# Altium schematic sheet Full_Schematic.SchDoc
size A3; SheetNumber: 1; SheetTotal: 1
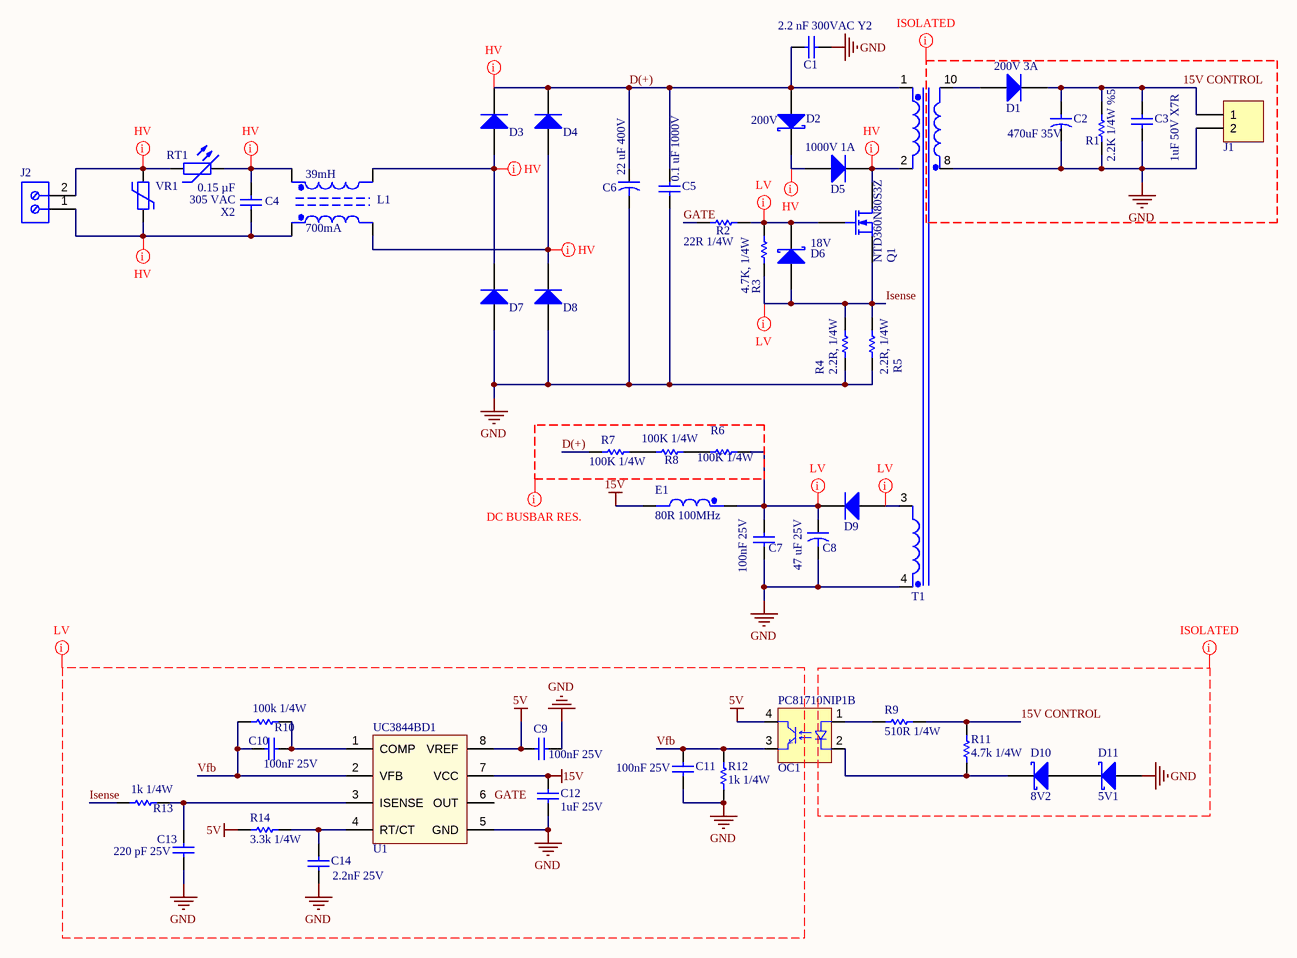
[diagram p0: Full_Schematic.SchDoc]

## Parts
C1  2.2 nF 300VAC Y2  [4x13x9]
C2  470uF 35V  [CAPPRD500W60D1025H1750]
C3  1uF 50V X7R  [1206]
C4  value 0.15 µF  Ratings: X2  Voltage Rating - AC: 305 VAC  [CFR F15 L18 B6 H12]  (hidden comment: MPX154K305E)
C5  0.1 uF 1000V  [RCE7U2J333J5B1H03B]
C6  22 uF 400V  [22uF 400V]
C7  100nF 25V  [1206]
C8  47 uF 25V  [CAPPRD200W50D525H1250]
C9  100nF 25V  [R 1206]
C10  100nF 25V  [1206]
C11  100nF 25V  [1206]
C12  1uF 25V  [R 1206]
C13  220 pF 25V  [1206]
C14  2.2nF 25V  [1206]
D1  200V 3A  [DO-201AD -Dik]
D2  200V  [DO-15((DO-204AC)]
D3  1N4007FLTR  [DO-214AA(SMB)]  (value not drawn)
D4  1N4007FLTR  [DO-214AA(SMB)]  (value not drawn)
D5  1000V 1A  [DO-214AA(SMB)]
D6  18V  [SOD-123]
D7  1N4007FLTR  [DO-214AA(SMB)]  (value not drawn)
D8  1N4007FLTR  [DO-214AA(SMB)]  (value not drawn)
D9  ES2D  [DO-214AA(SMB)]  (value not drawn)
D10  8V2  [SOD-123]
D11  5V1  [SOD-123]
E1  80R 100MHz  [1206 Bead]
J1  691210910002  [Header 2pin 2.54mm Vidalı]  (value not drawn)
J2  691214410002  [Header 2 Pin 7.62mm Vidalı]  (value not drawn)
L1  value 39mH  Max Current Rating: 700mA  [EMC SMPS TDK]  (hidden comment: 39mH 0.7A B82732R2701B030)
OC1  PC81710NIP1B  [PC817 SMD]
Q1  NTD360N80S3Z  [DPAK IGBT]
R1  2.2K 1/4W %5  [R 1206]
R2  22R 1/4W  [R 1206]
R3  4.7K, 1/4W  [R 1206]
R4  2.2R, 1/4W  [R 1206]
R5  2.2R, 1/4W  [R 1206]
R6  100K 1/4W  [R 1206]
R7  100K 1/4W  [R 1206]
R8  100K 1/4W  [R 1206]
R9  510R 1/4W  [R 1206]
R10  100k 1/4W  [R 1206]
R11  4.7k 1/4W  [R 1206]
R12  1k 1/4W  [1206]
R13  1k 1/4W  [R 1206]
R14  3.3k 1/4W  [R 1206]
RT1  NTC  B57153S0100M000  [NTC B57153S0100]  (value not drawn)
T1  SMPS Tr  [SMPS Tr3]  (value not drawn)
U1  UC3844BD1  [SOIC-OA8_L]
VR1  B72314P2301K101  [Varistor630V]  (value not drawn)

## Nets
5V: C9.1 OC1.4(C) R14.1 U1.8(VREF)
15V: C12.2 E1.2 U1.7(VCC)
GND: C1.2 C2.2 C3.1 C5.1 C6.2 C7.1 C8.2 C9.2 C11.1 C12.1 C13.1 C14.1 D7.1(A) D8.1(A) D11.1(A) J1.2 R1.1 R4.1 R5.1 R12.1 T1.4(Sec3-) T1.8 U1.5(GND)
15V CONTROL: C2.1 C3.2 D1.2(K) J1.1 R1.2 R9.1 R11.1
D(+): C1.1 C5.2 C6.1 D2.1(A) D3.2(K) D4.2(K) R7.1 T1.1(Pri+)
GATE: R2.2 U1.6(OUT)
Isense: D6.1(A) Q1.3(S) R3.1 R4.2 R5.2 R13.1
Vfb: C10.1 C11.2 OC1.3(E) R10.1 R12.2 U1.2(VFB)
NetC4_1: C4.1 J2.1 L1.1 VR1.1
NetC4_2: C4.2 L1.2 RT1.2
NetC7_2: C7.2 C8.1 D9.2(K) E1.1 R6.2
NetC10_2: C10.2 R10.2 U1.1(COMP)
NetC13_2: C13.2 R13.2 U1.3(ISENSE)
NetC14_2: C14.2 R14.2 U1.4(RT/CT)
NetD1_1: D1.1(A) T1.10(Sec1+)
NetD2_2: D2.2(K) D5.1(A)
NetD3_1: D3.1(A) D7.2(K) L1.3
NetD4_1: D4.1(A) D8.2(K) L1.4
NetD5_2: D5.2(K) Q1.2(D) T1.2(Pri-)
NetD6_2: D6.2(K) Q1.1(G) R2.1 R3.2
NetD9_1: D9.1(A) T1.3(Sec3+)
NetD10_1: D10.1(A) D11.2(K)
NetD10_2: D10.2(K) OC1.2(K) R11.2
NetJ2_2: J2.2 RT1.1 VR1.2
NetOC1_1: OC1.1(A) R9.2
NetR6_1: R6.1 R8.2
NetR7_2: R7.2 R8.1

## Layout directives
net class HV: D(+), NetC4_1, NetC4_2, NetD2_2, NetD3_1, NetD4_1, NetD5_2, NetJ2_2
net class ISO: 15V CONTROL, GND
net class LV: 5V, 15V, GATE, GND, Isense, NetC7_2, NetD6_2, NetD9_1, Vfb
net class DC BUSBAR: D(+)

## Notes on the sheet
- Document Name
- Prepared By
- Company Name
- Checked By
- A. Can KARACAN
- Release Date
- Department
- R&D- Hardware
- Size
- Change Date
- A3
- Approved By
- Sheet
- /

## Library data of the parts
C1 = Cap Y2 2.2nF 300V MKP TDK: Film Capacitor, Polypropylene, 1500V, 20% +Tol, 20% -Tol, 0.0022uF, Through Hole Mount; Manufacturer: TDK EPCOS; Manufacturer Part Number: B32021A3222M189; Designed By: Ahmet Can; Voltage Rating - AC: 300V; Value: 2.2nF; Published: 8-Jun-2000; LatestRevisionDate: 17-Jul-2002; LatestRevisionNote: Re-released for DXP Platform.; PackageReference: RAD-0.3; Publisher: Altium Limited; PackageDescription: Radial Cap, Thru-Hole; 2 Leads; 0.3 in Pin Spacing; Supplier: Digi-Key; Supplier Part Number: 495-4967-1-ND; RoHS: Yes; Category: Film Capacitors; Stock: 48399; Pricing: 1=0,69, 10=0,509, 50=0,407, 100=0,3488, 500=0,27614 (USD); ComponentLink1URL: https://datasheet.ciiva.com/26855/getdatasheetpartid-407539-26855093.pdf?src-supplier=Verical; ComponentLink1Description: https://datasheet.ciiva.com/26855/getdatasheetpartid-407539-26855093.pdf?src-supplier=Verical; ComponentLink2URL: https://datasheet.ciiva.com/7614/y2-b32021-026-7614902.pdf?src-supplier=Digi-Key; ComponentLink2Description: https://datasheet.ciiva.com/7614/y2-b32021-026-7614902.pdf?src-supplier=Digi-Key; ComponentLink3URL: https://datasheet.ciiva.com/2995/y2-b32021-026-2995030.pdf?src-supplier=Avnet; ComponentLink3Description: https://datasheet.ciiva.com/2995/y2-b32021-026-2995030.pdf?src-supplier=Avnet; Ratings: Y2
C2 = C 470uF 35V 1.76A 28mOhm: Cap Aluminum 470uF 35V 20% (10 X 16mm) Radial 5mm 1760mA 10000h 105 C Bulk; Manufacturer: Rubycon; Manufacturer Part Number: 35ZLH470MEFC10X16; Dielectric Material: Aluminium; Ripple Current: 1.76A; Life (Hours): 10000Hour; Impedance: 28mR; Leakage Current: 3uA; Lead Diameter: 0.6mm; Ripple Current @ High Frequency: 1.76 A @ 100 kHz; Designed By: Ahmet Can; Supplier: Digi-Key; Supplier Part Number: 1189-1890-ND; RoHS: Yes; Category: Aluminum Electrolytic Capacitors; Stock: 201638; Pricing: 1=0,69, 100=0,3201, 500=0,23712, 2500=0,18969 (USD); Mounting Technology: Through Hole; Case/Package: Radial; Min Operating Temperature: -40°C; Max Operating Temperature: 105°C; Value: 470uF; Tolerance: 20%; Termination: Radial; Voltage Rating: 35V; Packaging: Bulk; Voltage: 35V; Series: ZLH; Construction: RADIAL; Diameter: 10mm; Height: 16mm; Lead Pitch: 5mm; Radiation Hardening: No; Reach SVHC Compliant: No; Lead Free: Lead Free; RoHS Compliant: Yes; ComponentLink1URL: https://datasheet.ciiva.com/11690/e-zlh-11690967.pdf?src-supplier=Avnet; ComponentLink1Description: https://datasheet.ciiva.com/11690/e-zlh-11690967.pdf?src-supplier=Avnet; ComponentLink2URL: https://datasheet.ciiva.com/1456/50911-1456223.pdf?src-supplier=Element14; ComponentLink2Description: https://datasheet.ciiva.com/1456/50911-1456223.pdf?src-supplier=Element14
C3 C7 C9-C14 = C 1206: SMD 1206; Deger: *
C4 = Cap 150nF 305VAC X2: MPX Boxed Metalized Propylene X2 Class Interference Suppressor Film Capacitors; Manufacturer: Cornell Dubilier; Designed By: Ahmet Can; Supplier: Digi-Key; Supplier Part Number: 1572-1789-ND; Manufacturer Part Number: MPX154K305E; RoHS: No; Stock: 3283; Pricing: 1=0,5, 10=0,356, 40=0,26925, 80=0,2345, 500=0,17372, 1000=0,14766, 2500=0,13898, 5000=0,13029 (USD); ComponentLink1URL: http://www.illinoiscapacitor.com/pdf/seriesDocuments/MPX%20series.pdf?src-supplier=Digi-Key; ComponentLink1Description: http://www.illinoiscapacitor.com/pdf/seriesDocuments/MPX%20series.pdf?src-supplier=Digi-Key
C5 = C Seramik 100nF 1kV X7R 5mm: Cap Ceramic 0.1uF 1000V X7R 10% Radial 5mm 125°C Bulk; Manufacturer: Murata; Manufacturer Part Number: RDER73A104K5B1H03B; Value: 100nF; Voltage Rated: 1 kW; Published: 8-Jun-2000; LatestRevisionDate: 17-Jul-2002; LatestRevisionNote: Re-released for DXP Platform.; PackageReference: RAD-0.3; Publisher: Altium Limited; PackageDescription: Radial Cap, Thru-Hole; 2 Leads; 0.3 in Pin Spacing; Supplier: Digi-Key; Supplier Part Number: 490-8944-ND; RoHS: Yes; Category: Ceramic Capacitors; Stock: 3259; Pricing: 1=1,31, 10=1,037, 50=0,8988, 100=0,7778, 500=0,5877, 1000=0,51856, 2500=0,48399, 5000=0,46671 (USD); ComponentLink1URL: https://datasheet.ciiva.com/29539/product-29539039.pdf?src-supplier=Digi-Key; ComponentLink1Description: https://datasheet.ciiva.com/29539/product-29539039.pdf?src-supplier=Digi-Key
C6 = C 22uF 400V 270mArms: Cap Aluminum Lytic 22uF 400V 20%( 12.5 X 16mm) Radial 5mm 180mA 2000h 105C; Manufacturer: Rubycon; Manufacturer Part Number: 400AX22MEFC12.5X16; Ripple Current @ Low Frequency: 180 mA @ 120 Hz; Ripple Current @ High Frequency: 270 mA @ 100 kHz; Designed By: Ahmet Can; Supplier: Digi-Key; Supplier Part Number: 1189-3123-ND; RoHS: Yes; Category: Aluminum Electrolytic Capacitors; Stock: 415; Pricing: 1=1,01, 10=0,768, 50=0,6378, 100=0,5493, 500=0,42524, 1000=0,36617, 2500=0,34255, 5000=0,32483 (USD); Mounting Technology: Through Hole; Case/Package: Radial; Min Operating Temperature: -40°C; Max Operating Temperature: 105°C; Value: 22uF; Voltage Rating: 400V; Tolerance: 20%; Series: AX; RoHS Compliant: Yes; ComponentLink1URL: http://www.rubycon.co.jp/en/catalog/e_pdfs/aluminum/Radial_Lead_Alumi_Eng.pdf?src-supplier=Digi-Key; ComponentLink1Description: http://www.rubycon.co.jp/en/catalog/e_pdfs/aluminum/Radial_Lead_Alumi_Eng.pdf?src-supplier=Digi-Key
C8 = C 47uF 25V 250mArms 400mOhm: RUBYCON         25YXJ47MTA5X11            Electrolytic Capacitor, Miniature, YXJ Series, 47 F,  20%, 25 V, 5 mm, Radial Leaded; Value: 47uF; Ripple Current: 175mA; Impedance: 400mR; Designed By: Ahmet Can; ComponentLink1Description: https://datasheet.ciiva.com/6328/e-yxj-6328843.pdf?src-supplier=Digi-Key; Supplier: Digi-Key; Supplier Part Number: 1189-1590-1-ND; Manufacturer: Rubycon; Manufacturer Part Number: 25YXJ47MTA5X11; RoHS: Yes; Category: Aluminum Electrolytic Capacitors; Stock: 28516; Pricing: 1=0,26, 10=0,176, 50=0,1056, 100=0,0892, 500=0,06106, 1000=0,05401 (USD); Mounting Technology: Through Hole; Case/Package: Radial; Min Operating Temperature: -40°C; Max Operating Temperature: 105°C; Tolerance: 20%; Voltage Rating: 25V; Package Quantity: 2000; Packaging: Cut Tape; Voltage Rating (DC): 25V; Features: General Purpose; Series: YXJ; Diameter: 5mm; Height: 11mm; Lead Pitch: 0.079inch; Height - Seated (Max): 0.492inch; Reach SVHC Compliant: No; RoHS Compliant: Yes; ComponentLink1URL: https://datasheet.ciiva.com/6328/e-yxj-6328843.pdf?src-supplier=Digi-Key; ComponentLink2URL: https://datasheet.ciiva.com/22732/1657883-22732557.pdf?src-supplier=Element14; ComponentLink2Description: https://datasheet.ciiva.com/22732/1657883-22732557.pdf?src-supplier=Element14
D1 = Diyot DO-201AD Dik: Diode Schottky 200V 3A DO201AD; Manufacturer: Sangdest Microelectronics; Manufacturer Part Number: SB3200; Designed By: Ahmet Can; Supplier: Digi-Key; Supplier Part Number: 1655-SB3200CT-ND; RoHS: Yes; Category: Uncategorized; Stock: 8735; Pricing: 1=0,43, 10=0,33, 100=0,198, 500=0,18332 (USD); RoHS Compliant: Yes
D2 = TVS 200V DO-15: Diode Transient Voltage Suppression (TVS) Single Unidirectional 171 Volt 600 Watt 2-Pin DO-15; Manufacturer: STMicroelectronics; Manufacturer Part Number: P6KE200A; Max Clamping Voltage: 353 V; Min Breakdown Voltage: 190 V; Designed By: Ahmet Can; ComponentLink1Description: Manufacturer Link; ComponentLink1URL: http://www.infineon.com/; ComponentLink2Description: Datasheet; ComponentLink2URL: http://www.infineon.com/upload/Document/cmc_upload/documents/009/363/bat17series.pdf; Supplier: Digi-Key; Supplier Part Number: 497-13419-1-ND; RoHS: Yes; Category: TVS Diodes; Stock: 5060; Pricing: 1=0,64, 10=0,567, 100=0,4347, 500=0,34366 (USD); ComponentLink3URL: https://datasheet.ciiva.com/6577/cd00000720-6577909.pdf?src-supplier=Digi-Key; ComponentLink3Description: https://datasheet.ciiva.com/6577/cd00000720-6577909.pdf?src-supplier=Digi-Key; ComponentLink4URL: https://datasheet.ciiva.com/14535/70013976-14535693.pdf?src-supplier=Allied+Electronics; ComponentLink4Description: https://datasheet.ciiva.com/14535/70013976-14535693.pdf?src-supplier=Allied+Electronics; ComponentLink5URL: https://datasheet.ciiva.com/41443/001184001-da-01-en-tvs-diode-171v-1ch-un-p6ke200a-do-15-stm-41443451.pdf?src-supplier=Conrad; ComponentLink5Description: https://datasheet.ciiva.com/41443/001184001-da-01-en-tvs-diode-171v-1ch-un-p6ke200a-do-15-stm-41443451.pdf?src-supplier=Conrad
D3 D4 D7 D8 = D 1N4007 DO-214AA(SMB): Standard Rectifier 1000V SOD-123; DC Reverse Max: 1 kV; Designed By: Ahmet Can
D5 = D 1N4007 DO-214AA(SMB): Standard Rectifier 1000V SOD-123, 1N4007FLTR; DC Reverse Max: 1 kV; Designed By: Ahmet Can
D6 D10 D11 = Zener SOD-123: SOD-123; Note: Pin 2 is not connected and not drawn.; Published: 21-Mar-2003; LatestRevisionDate: 29-May-2009; LatestRevisionNote: IPC-7351 Footprint Added.; DatasheetVersion: Oct-1999; PackageVersion: Sep-2001; PackageReference: SOT-23; Publisher: Altium Limited; PackageDescription: 3-Pin SOT-23 Package 0.95 mm Pitch, 2.5 mm Lead Span; ComponentLink1Description: Manufacturer Link; ComponentLink1URL: http://www.infineon.com/; ComponentLink2Description: Datasheet; ComponentLink2URL: http://www.infineon.com/upload/Document/cmc_upload/documents/009/363/bat17series.pdf
D9 = D ES2D: Superfast Recovery Rectifier , DO-214AA/SMB, 200V, 2.00A, 20ns; Manufacturer: ON Semiconductor / Fairchild; Designed By: Ahmet Can; Average Rectified Current: 2A; Supplier: Digi-Key; Supplier Part Number: ES2DFSCT-ND; Manufacturer Part Number: ES2D; RoHS: Yes; Category: Rectifier Diodes; Stock: 831429; Pricing: 1=0,5, 10=0,406, 100=0,2767, 500=0,2075, 1000=0,15562 (USD); ComponentLink1URL: https://datasheet.ciiva.com/910/es2a-910816.pdf?src-supplier=Digi-Key; ComponentLink1Description: https://datasheet.ciiva.com/910/es2a-910816.pdf?src-supplier=Digi-Key; ComponentLink2URL: https://datasheet.ciiva.com/8303/es2d-8303722.pdf?src-supplier=Avnet; ComponentLink2Description: https://datasheet.ciiva.com/8303/es2d-8303722.pdf?src-supplier=Avnet; ComponentLink3URL: https://datasheet.ciiva.com/910/es2a-910814.pdf?src-supplier=Digi-Key; ComponentLink3Description: https://datasheet.ciiva.com/910/es2a-910814.pdf?src-supplier=Digi-Key; ComponentLink4URL: https://datasheet.ciiva.com/910/es2a-910815.pdf?src-supplier=Digi-Key; ComponentLink4Description: https://datasheet.ciiva.com/910/es2a-910815.pdf?src-supplier=Digi-Key; Voltage Reverse Max: 200V
E1 = Ferrite Bead 1206: Ferrite Beads Multi-Layer 50Ohm 25% 100MHz 3A 25mOhm DCR 1206 T/R, 742792114; Manufacturer: Wurth Electronics; Impedance: 50R; Max DC Current: 3mA; DC Resistance (DCR): 40mR; Number of Lines: 1; Value: 12nH; Shielding: Unshielded; Designed By: Ahmet Can; Supplier: Digi-Key; Supplier Part Number: 732-1621-1-ND; Manufacturer Part Number: 742792114; RoHS: Yes; Category: Ferrite Beads and Chips; Stock: 42539; Pricing: 1=0,26, 10=0,253, 50=0,234, 100=0,222, 500=0,213, 1000=0,203 (USD); Mounting Technology: Surface Mount; Case/Package: SMD/SMT; Core Material: Ferrite; Weight: 0.000988oz; Case Code (Metric): 3216; Case Code (Imperial): 1206; Min Operating Temperature: -55°C; Max Operating Temperature: 125°C; Tolerance: 25%; Packaging: Tape and Reel; Package Quantity: 1; Current Rating: 3A; Max Current Rating: 3A; Termination: SMD/SMT; Test Frequency: 100MHz; Series: WE-CBF; Length: 3.2mm; Width: 1.6mm; Height: 0.051inch; Depth: 1.8mm; Lead Free: Lead Free; RoHS Compliant: Yes; Reach SVHC Compliant: Unknown; ComponentLink1URL: https://datasheet.ciiva.com/1013/742792114-1013593.pdf?src-supplier=Digi-Key; ComponentLink1Description: https://datasheet.ciiva.com/1013/742792114-1013593.pdf?src-supplier=Digi-Key; ComponentLink2URL: https://datasheet.ciiva.com/23762/742792114-23762943.pdf?src-supplier=Newark; ComponentLink2Description: https://datasheet.ciiva.com/23762/742792114-23762943.pdf?src-supplier=Newark; ComponentLink3URL: https://datasheet.ciiva.com/1126/1695965-1126674.pdf?src-supplier=Element14; ComponentLink3Description: https://datasheet.ciiva.com/1126/1695965-1126674.pdf?src-supplier=Element14; ComponentLink4URL: https://datasheet.ciiva.com/11795/0900766b80bbd134-11795825.pdf?src-supplier=Rs; ComponentLink4Description: https://datasheet.ciiva.com/11795/0900766b80bbd134-11795825.pdf?src-supplier=Rs; ComponentLink5URL: https://datasheet.ciiva.com/4940/742792114-88586-4940440.pdf?src-supplier=Mouser; ComponentLink5Description: https://datasheet.ciiva.com/4940/742792114-88586-4940440.pdf?src-supplier=Mouser; ComponentLink6URL: https://datasheet.ciiva.com/14122/742792114-eng-tds-14122774.pdf?src-supplier=Distrelec; ComponentLink6Description: https://datasheet.ciiva.com/14122/742792114-eng-tds-14122774.pdf?src-supplier=Distrelec; ComponentLink7URL: https://datasheet.ciiva.com/22711/1695965-22711371.pdf?src-supplier=Element14; ComponentLink7Description: https://datasheet.ciiva.com/22711/1695965-22711371.pdf?src-supplier=Element14; ComponentLink8URL: https://datasheet.ciiva.com/1013/742792114-1013595.pdf?src-supplier=Digi-Key; ComponentLink8Description: https://datasheet.ciiva.com/1013/742792114-1013595.pdf?src-supplier=Digi-Key
J1 = Header 2 Pin 2.54mm TH: Tb, Wire To Brd, R/A, 2Way, 18Awg Rohs Compliant: Yes |Wurth Elektronik 691210910002; Manufacturer: Wurth Electronics; Plating: Brass,Steel; Number of Positions Per Level: 2; Number of Levels: 1; Current: 6A; Voltage: 150V; Number of Contacts: 2NUMBER; Wire Gauge (Max): 30AWG; Designed By: Ahmet Can; LatestRevisionDate: 17-Jul-2002; LatestRevisionNote: Re-released for DXP Platform.; Publisher: Altium Limited; Supplier: Digi-Key; Supplier Part Number: 732-691210910002-ND; Manufacturer Part Number: 691210910002; RoHS: Yes; Category: Terminal Blocks; Stock: 2068; Pricing: 1=1,14, 10=1,043, 50=0,984, 100=0,905, 500=0,748 (USD); Mounting Technology: Through Hole; Color: Green; Contact Plating: Brass,Tin; Housing Material: Nylon; Contact Material: 154ConductorMaterial; Min Operating Temperature: -40°C; Max Operating Temperature: 105°C; Series: WR-TBL Series 2109; Termination: Screw; Current Rating: 6A; Number of Rows: 1NUMBER; Voltage Rating: 150V; Height: 8.7mm; Wire Gauge (Min): 18AWG; RoHS Compliant: Yes; ComponentLink1URL: https://katalog.we-online.de/em/datasheet/6912109100xx.pdf?src-supplier=Digi-Key; ComponentLink1Description: https://katalog.we-online.de/em/datasheet/6912109100xx.pdf?src-supplier=Digi-Key
J2 = Header 2pin 7.62mm TH: 7.62 Mm Terminal Block, Horizont; Part Number: 691218410002; Manufacturer: Wurth Electronics; Compliance: Lead free / RoHS; Modularity: Yes; PCB/Cable/Panel: PCB; Pin Number: 2; Pitch: 7.62mm; Rated Current [UL]: 30A; Working Voltage [UL]: 300VAC; Designed By: Ahmet Can; ComponentLink1Description: Manufacturer; ComponentLink1URL: http://www.we-online.de; ComponentLink2URL: https://katalog.we-online.de/em/datasheet/691218410002.pdf; ComponentLink2Description: Datasheet; Mounting Technology: THT; Packaging: Box; Operating Temperature: -40 to +105degC; Published Date: October 2019; Type: Horizontal; Publisher: Wurth Elektronik; Application: Rising Cage Clamp; Supplier: Digi-Key; Supplier Part Number: 732-691214410002-ND; Manufacturer Part Number: 691214410002; RoHS: No; Category: Terminal Blocks; Stock: 193; Pricing: 1=1,27, 10=1,135, 50=1,054, 100=0,97, 500=0,722 (USD); ComponentLink3URL: https://katalog.we-online.de/em/datasheet/6912144100xx.pdf?src-supplier=Digi-Key; ComponentLink3Description: https://katalog.we-online.de/em/datasheet/6912144100xx.pdf?src-supplier=Digi-Key
L1 = EMC SMPS TDK 39mH 0.7A: Common Mode Chokes Dual 39mH 10kHz 700mA Thru-Hole Box; Manufacturer: TDK EPCOS; Core Material: Ferrite; Inductance Tolerance: -30%; Tolerance: 50%; Number of Lines: 2; Voltage Rating (AC): 250V; Designed By: Ahmet Can; Supplier: Digi-Key; Supplier Part Number: 495-2781-ND; Manufacturer Part Number: B82732R2701B030; RoHS: Yes; Category: Uncategorized; Stock: 1298; Pricing: 1=3,13, 10=2,843, 25=2,388, 40=2,04675, 80=1,933, 230=1,8193, 640=1,76244, 1280=1,64873, 2560=1,59188 (USD); Mounting Technology: Through Hole; Pins: 4; Weight: 0.35274oz; Min Operating Temperature: -40°C; Max Operating Temperature: 125°C; Current Rating: 700mA; Packaging: Tray; Package Quantity: 640; Max DC Current: 700mA; Termination: Radial; Series: B82732; Length: 24mm; Width: 16.5mm; Height: 23mm; Reach SVHC Compliant: No; RoHS Compliant: Yes; ComponentLink1URL: https://datasheet.ciiva.com/4956/b82732r-w-58440-4956336.pdf?src-supplier=Mouser; ComponentLink1Description: https://datasheet.ciiva.com/4956/b82732r-w-58440-4956336.pdf?src-supplier=Mouser
OC1 = PC817: Optocoupler 1-CH Open Collector 5000Vrms 4-Pin DIP SMD T/R; Manufacturer: Sharp; Designed By: Ahmet Can; Supplier: Mouser; Supplier Part Number: 852-PC81710NIP1B; Manufacturer Part Number: PC81710NIP1B; RoHS: Yes; Stock: 9668; Pricing: 1=1, 10=0,636, 50=0,636, 100=0,471, 1000=0,356, 10000=0,322 (USD); RoHS Compliant: Yes
Q1 = MOSFET DPAK: MOSFET – Power, N-Channel, SUPERFET® III, 800 V, 13 A, 360 mΩ, DPAK; Manufacturer: ON Semiconductor; Published: 8-Jun-2000; LatestRevisionDate: 17-Jul-2002; LatestRevisionNote: Re-released for DXP Platform.; PackageVersion: 1995/1996; PackageReference: E3; Publisher: Altium Limited; PackageDescription: TO, Flat Index; 3 In-Line, Axial Leads; Body Dia. 4.6mm; Lead Dia. 0.5 mm (max); Supplier: Digi-Key; Supplier Part Number: 488-NTD360N80S3ZDKR-ND; Manufacturer Part Number: NTD360N80S3Z; RoHS: Yes; Category: MOSFETs; Pricing: 1=2,74, 10=2,304, 100=1,8638, 500=1,65672, 1000=1,41857 (USD)
R1-R14 = R 1206: SMD 1206; Deger: *
RT1 = NTC 10R 2A 8.5mm: Inrush current limiters include PTC and NTC Thermistors.; Manufacturer: TDK EPCOS; Designed By: Ahmet Can; Published: 8-Jun-2000; LatestRevisionDate: 17-Jul-2002; LatestRevisionNote: Re-released for DXP Platform.; PackageReference: AXIAL-0.4; Publisher: Altium Limited; PackageDescription: Axial Device, Thru-Hole; 2 Leads; 0.4 in Pin Spacing; Supplier: Digi-Key; Supplier Part Number: 495-2076-ND; Manufacturer Part Number: B57153S0100M000; RoHS: Yes; Category: Thermistors; Stock: 24887; Pricing: 1=0,6, 5=0,582, 10=0,564, 50=0,4748, 100=0,3942, 250=0,35836, 500=0,3046, 1000=0,26876, 5000=0,24188 (USD); ComponentLink1URL: https://datasheet.ciiva.com/15097/getdatasheetpartid-116248-15097684.pdf?src-supplier=Verical; ComponentLink1Description: https://datasheet.ciiva.com/15097/getdatasheetpartid-116248-15097684.pdf?src-supplier=Verical; ComponentLink2URL: https://datasheet.ciiva.com/29386/419723-da-01-en-ntc-sensor-b57153s0100m000-29386959.pdf?src-supplier=Conrad; ComponentLink2Description: https://datasheet.ciiva.com/29386/419723-da-01-en-ntc-sensor-b57153s0100m000-29386959.pdf?src-supplier=Conrad; ComponentLink3URL: https://datasheet.ciiva.com/48779/1899131-48779797.pdf?src-supplier=Element14; ComponentLink3Description: https://datasheet.ciiva.com/48779/1899131-48779797.pdf?src-supplier=Element14
T1 = SMPS Tr EF25: Sim Note: Enter the turns ratios, Core loss resistance, Magnetising Reactance, Leakage Reactances and Resistances referred to the primary side into the parameter fields.; Published: 25-Jan-2001; LatestRevisionDate: 17-Jul-2002; LatestRevisionNote: Re-released for DXP Platform.; PackageReference: TRF_8; Publisher: Altium Limited; PackageDescription: Transformer; 8 Leads
U1 = UC3844BD1: Off-Line Controllers 52kHz 1A Current PWM No-Cancel/No-Return; Manufacturer: STMicroelectronics; PackageReference: SOIC-OA8; Supplier: Digi-Key; Supplier Part Number: 497-18661-ND; Manufacturer Part Number: UC3844BD1; RoHS: Yes; Category: Voltage Regulators - Switching; Stock: 4300; Pricing: 1=0,98, 10=0,874, 25=0,8296, 100=0,6814, 250=0,637, 500=0,56292, 1000=0,4444, 2500=0,41478, 5000=0,39404 (USD); ComponentLink1URL: https://datasheet.ciiva.com/15108/getdatasheetpartid-52862-15108108.pdf?src-supplier=Verical; ComponentLink1Description: https://datasheet.ciiva.com/15108/getdatasheetpartid-52862-15108108.pdf?src-supplier=Verical; ComponentLink2URL: https://datasheet.ciiva.com/17081/0900766b80db28f5-17081456.pdf?src-supplier=Allied+Electronics; ComponentLink2Description: https://datasheet.ciiva.com/17081/0900766b80db28f5-17081456.pdf?src-supplier=Allied+Electronics; ComponentLink3URL: https://datasheet.ciiva.com/16502/cd00000966-16502267.pdf?src-supplier=Future+Electronics; ComponentLink3Description: https://datasheet.ciiva.com/16502/cd00000966-16502267.pdf?src-supplier=Future+Electronics; ComponentLink4URL: https://datasheet.ciiva.com/2019/cd00000966-2019685.pdf?src-supplier=Digi-Key; ComponentLink4Description: https://datasheet.ciiva.com/2019/cd00000966-2019685.pdf?src-supplier=Digi-Key
VR1 = Varistor V20E320P: Varistor Metal Oxide 350pF 50A 470V Through Hole Bulk; Manufacturer: TDK EPCOS; Max AC Volt: 300V; Designed By: Ahmet Can; Max DC Volt: 385V; Supplier: Digi-Key; Supplier Part Number: 495-B72314P2301K101-ND; Manufacturer Part Number: B72314P2301K101; RoHS: No; Stock: 29407; Pricing: 1=0,86, 10=0,766, 25=0,7268, 100=0,597, 250=0,55808, 500=0,49318, 1000=0,38936, 2500=0,3634, 5000=0,34523 (USD); Package/Case: 14mm Disc